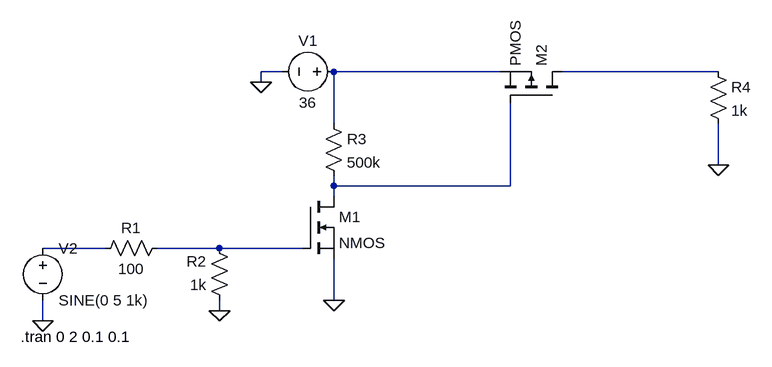
[diagram p0: schematic Circuit.asc]
Circuit.asc, the LTspice schematic file:
Version 4
SHEET 1 880 680
WIRE 112 -80 80 -80
WIRE 448 -80 192 -80
WIRE 784 -80 544 -80
WIRE 80 -64 80 -80
WIRE 192 0 192 -80
WIRE 784 64 784 0
WIRE 192 96 192 80
WIRE 464 96 464 -32
WIRE 464 96 192 96
WIRE 192 112 192 96
WIRE -160 192 -256 192
WIRE 16 192 -80 192
WIRE 144 192 16 192
WIRE 192 272 192 208
WIRE 16 288 16 272
WIRE -256 304 -256 272
FLAG 192 272 0
FLAG 16 288 0
FLAG 80 -64 0
FLAG -256 304 0
FLAG 784 64 0
SYMBOL nmos 144 112 R0
SYMATTR InstName M1
SYMBOL res -64 176 R90
WINDOW 0 0 56 VBottom 2
WINDOW 3 32 56 VTop 2
SYMATTR InstName R1
SYMATTR Value 100
SYMBOL res 32 288 R180
WINDOW 0 36 76 Left 2
WINDOW 3 36 40 Left 2
SYMATTR InstName R2
SYMATTR Value 1k
SYMBOL res 176 -16 R0
SYMATTR InstName R3
SYMATTR Value 500k
SYMBOL voltage 208 -80 R90
WINDOW 0 -32 56 VBottom 2
WINDOW 3 32 56 VTop 2
WINDOW 123 0 0 Left 0
WINDOW 39 0 0 Left 0
SYMATTR InstName V1
SYMATTR Value 36
SYMBOL voltage -256 176 R0
WINDOW 123 0 0 Left 0
WINDOW 39 0 0 Left 0
SYMATTR InstName V2
SYMATTR Value SINE(0 5 1k)
SYMBOL pmos 544 -32 M270
SYMATTR InstName M2
SYMBOL res 768 -96 R0
SYMATTR InstName R4
SYMATTR Value 1k
TEXT -290 328 Left 2 !.tran 0 2 0.1 0.1

The netlist it stands for:
* Circuit.asc
M1 N003 N005 0 0 NMOS
R1 N005 N004 100
R2 0 N005 1k
R3 N001 N003 500k
V1 N001 0 36
V2 N004 0 SINE(0 5 1k)
M2 N002 N003 N001 N001 PMOS
R4 N002 0 1k
.model NMOS NMOS
.model PMOS PMOS
.lib standard.mos
.tran 0 2 0.1 0.1
.backanno
.end